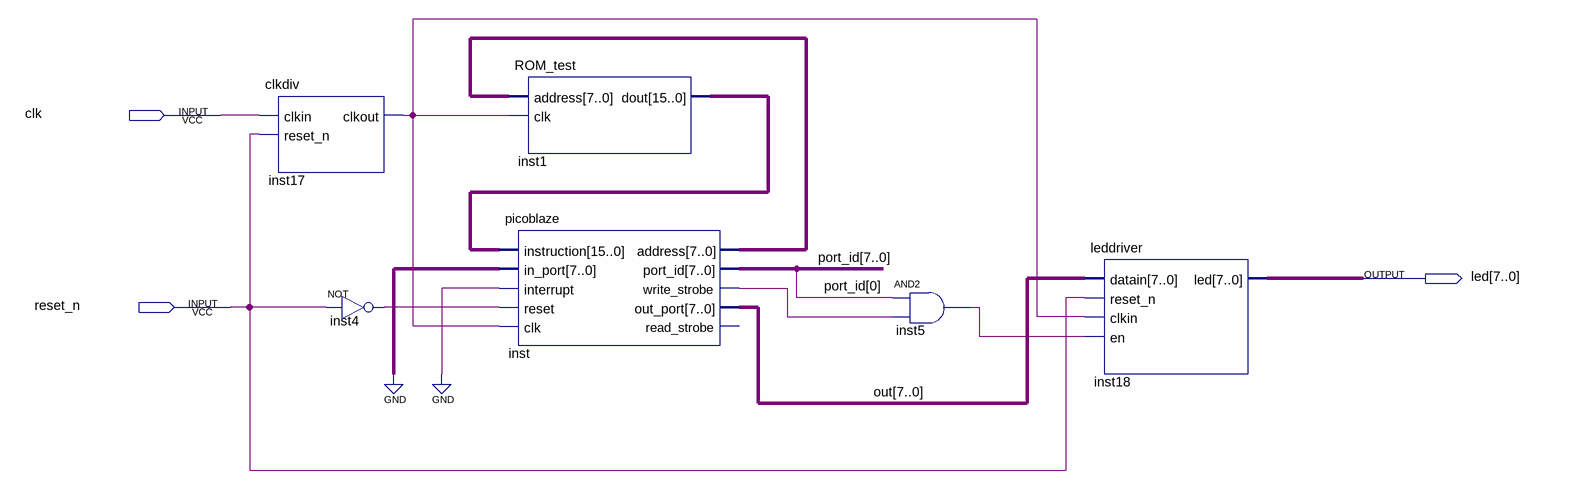
[diagram p0: schematic sheet]
// Quartus schematic MAXII_PicoBlaze.bdf as structural Verilog: 6 symbols, 3 pins
module MAXII_PicoBlaze (
  input  clk,
  input  reset_n,
  output [7:0] led
);

  wire inst4_out, inst5_out, inst17_clkout, inst_write_strobe;
  wire [7:0] inst_address, out, port_id;
  wire [15:0] inst1_dout;

  clkdiv inst17 (.clkin(clk), .reset_n(reset_n), .clkout(inst17_clkout));
  not inst4 (inst4_out, reset_n);
  ROM_test inst1 (.address(inst_address), .clk(inst17_clkout), .dout(inst1_dout));
  picoblaze inst (
    .instruction(inst1_dout), .in_port({8{1'b0}}), .interrupt(1'b0), .reset(inst4_out), .clk(inst17_clkout),
    .address(inst_address), .port_id(port_id), .write_strobe(inst_write_strobe), .out_port(out));  // open: read_strobe
  and inst5 (inst5_out, port_id[0], inst_write_strobe);
  leddriver inst18 (.datain(out), .reset_n(reset_n), .clkin(inst17_clkout), .en(inst5_out), .led(led));
endmodule
